# Altium schematic sheet S7CAS-PLEIADES-CARTE-MERE_P20_DAC-ADC-Decoupling.SchDoc
size Tabloid; SheetNumber: 18; SheetTotal: 20; Sheet_Name: DAC ADC Decoupling; Size: 11x17
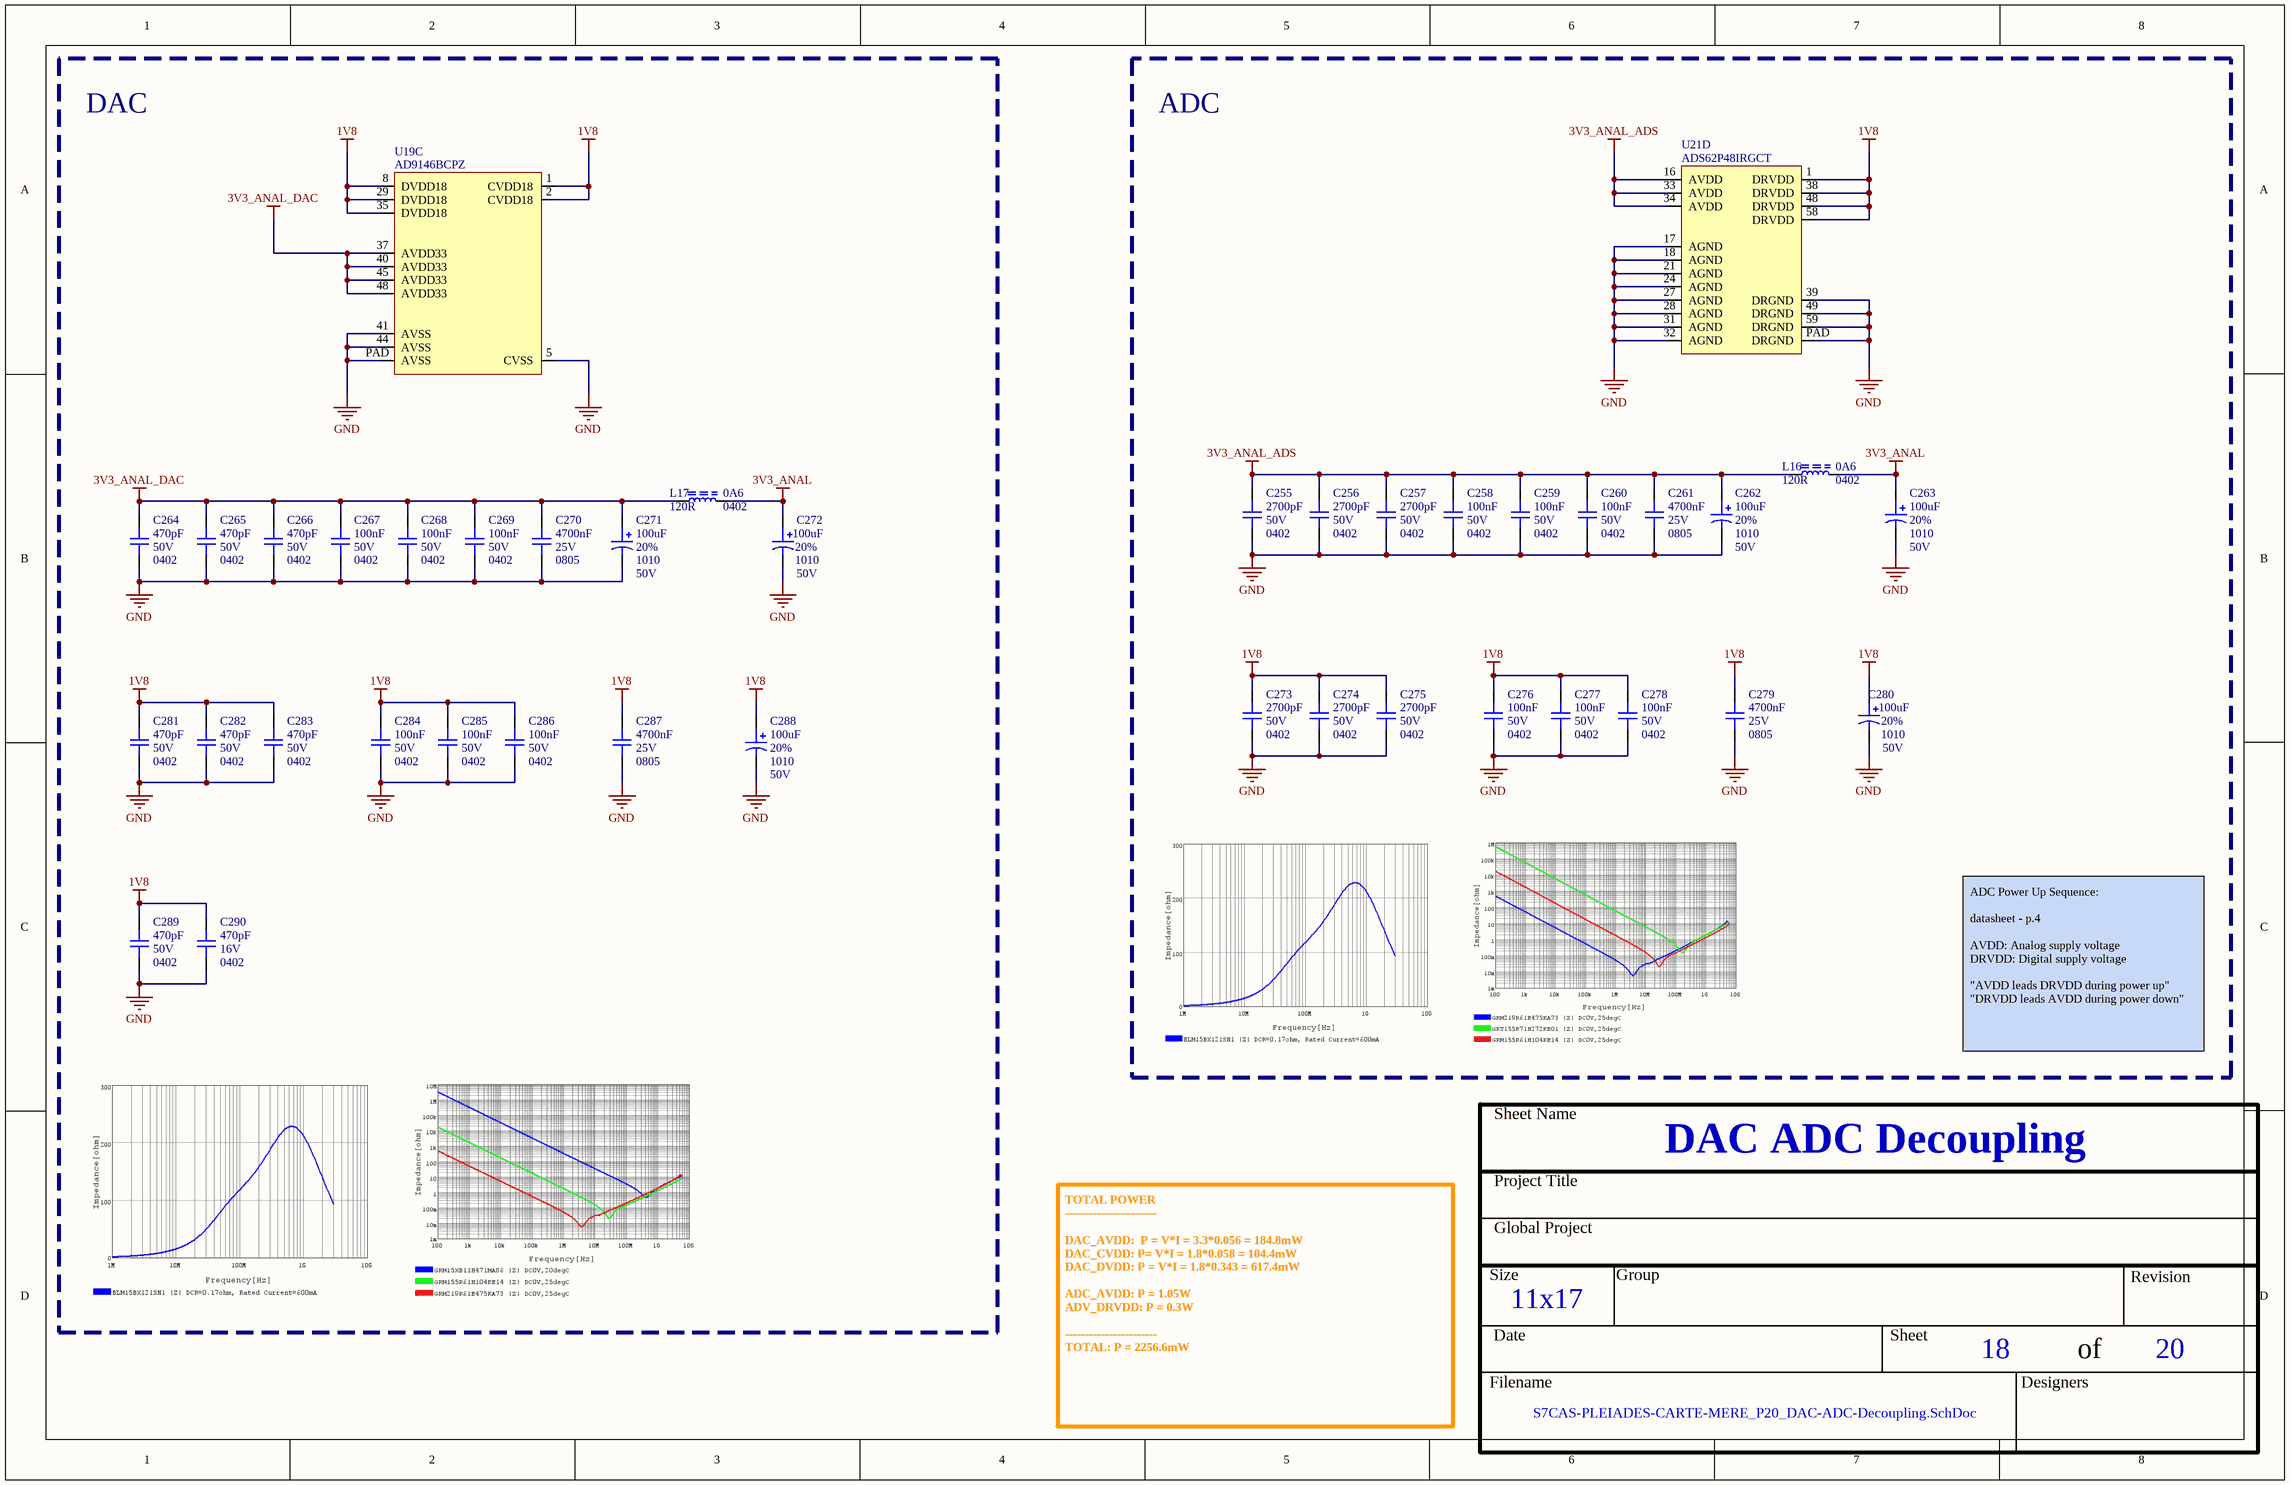
[diagram p0: S7CAS-PLEIADES-CARTE-MERE_P20_DAC-ADC-Decoupling.SchDoc]

## Parts
C255  value 2700pF  Voltage: 50V  Package: 0402  [CAP_0402]  (hidden comment: CAP - 0402)
C256  value 2700pF  Voltage: 50V  Package: 0402  [CAP_0402]  (hidden comment: CAP - 0402)
C257  value 2700pF  Voltage: 50V  Package: 0402  [CAP_0402]  (hidden comment: CAP - 0402)
C258  value 100nF  Voltage: 50V  Package: 0402  [CAP_0402]  (hidden comment: CAP - 0402)
C259  value 100nF  Voltage: 50V  Package: 0402  [CAP_0402]  (hidden comment: CAP - 0402)
C260  value 100nF  Voltage: 50V  Package: 0402  [CAP_0402]  (hidden comment: CAP - 0402)
C261  value 4700nF  Voltage: 25V  Package: 0805  [CAP_0805]  (hidden comment: CAP - 0805)
C262  value 100uF  Voltage: 50V  Package: 1010  Precision: 20%  [CAP_ALU_1010_vishay]  (hidden comment: MAL215099101E3)
C263  value 100uF  Voltage: 50V  Package: 1010  Precision: 20%  [CAP_ALU_1010_vishay]  (hidden comment: MAL215099101E3)
C264  value 470pF  Voltage: 50V  Package: 0402  [CAP_0402]  (hidden comment: CAP - 0402)
C265  value 470pF  Voltage: 50V  Package: 0402  [CAP_0402]  (hidden comment: CAP - 0402)
C266  value 470pF  Voltage: 50V  Package: 0402  [CAP_0402]  (hidden comment: CAP - 0402)
C267  value 100nF  Voltage: 50V  Package: 0402  [CAP_0402]  (hidden comment: CAP - 0402)
C268  value 100nF  Voltage: 50V  Package: 0402  [CAP_0402]  (hidden comment: CAP - 0402)
C269  value 100nF  Voltage: 50V  Package: 0402  [CAP_0402]  (hidden comment: CAP - 0402)
C270  value 4700nF  Voltage: 25V  Package: 0805  [CAP_0805]  (hidden comment: CAP - 0805)
C271  value 100uF  Voltage: 50V  Package: 1010  Precision: 20%  [CAP_ALU_1010_vishay]  (hidden comment: MAL215099101E3)
C272  value 100uF  Voltage: 50V  Package: 1010  Precision: 20%  [CAP_ALU_1010_vishay]  (hidden comment: MAL215099101E3)
C273  value 2700pF  Voltage: 50V  Package: 0402  [CAP_0402]  (hidden comment: CAP - 0402)
C274  value 2700pF  Voltage: 50V  Package: 0402  [CAP_0402]  (hidden comment: CAP - 0402)
C275  value 2700pF  Voltage: 50V  Package: 0402  [CAP_0402]  (hidden comment: CAP - 0402)
C276  value 100nF  Voltage: 50V  Package: 0402  [CAP_0402]  (hidden comment: CAP - 0402)
C277  value 100nF  Voltage: 50V  Package: 0402  [CAP_0402]  (hidden comment: CAP - 0402)
C278  value 100nF  Voltage: 50V  Package: 0402  [CAP_0402]  (hidden comment: CAP - 0402)
C279  value 4700nF  Voltage: 25V  Package: 0805  [CAP_0805]  (hidden comment: CAP - 0805)
C280  value 100uF  Voltage: 50V  Package: 1010  Precision: 20%  [CAP_ALU_1010_vishay]  (hidden comment: MAL215099101E3)
C281  value 470pF  Voltage: 50V  Package: 0402  [CAP_0402]  (hidden comment: CAP - 0402)
C282  value 470pF  Voltage: 50V  Package: 0402  [CAP_0402]  (hidden comment: CAP - 0402)
C283  value 470pF  Voltage: 50V  Package: 0402  [CAP_0402]  (hidden comment: CAP - 0402)
C284  value 100nF  Voltage: 50V  Package: 0402  [CAP_0402]  (hidden comment: CAP - 0402)
C285  value 100nF  Voltage: 50V  Package: 0402  [CAP_0402]  (hidden comment: CAP - 0402)
C286  value 100nF  Voltage: 50V  Package: 0402  [CAP_0402]  (hidden comment: CAP - 0402)
C287  value 4700nF  Voltage: 25V  Package: 0805  [CAP_0805]  (hidden comment: CAP - 0805)
C288  value 100uF  Voltage: 50V  Package: 1010  Precision: 20%  [CAP_ALU_1010_vishay]  (hidden comment: MAL215099101E3)
C289  value 470pF  Voltage: 50V  Package: 0402  [CAP_0402]  (hidden comment: CAP - 0402)
C290  value 470pF  Voltage: 16V  Package: 0402  [CAP_0402]  (hidden comment: CAP - 0402)
L16  value 120R  Current: 0A6  Package: 0402  [FER_0402]  (hidden comment: FER - 0402)
L17  value 120R  Current: 0A6  Package: 0402  [FER_0402]  (hidden comment: FER - 0402)
U19  AD9146BCPZ  [DAC_AD9146BCPZ]  (part C of 3)
U21  ADS62P48IRGCT  [ADC_ADS62P48IRGCT]  (part D of 4)

## Blocks framed on the sheet
DAC: C264-C272 C281-C290 L17 U19
ADC: C255-C263 C273-C280 L16 U21

## Nets
1V8: C273.2 C274.2 C275.2 C276.2 C277.2 C278.2 C279.2 C280.1 C281.2 C282.2 C283.2 C284.2 C285.2 C286.2 C287.2 C288.1 C289.2 C290.2 U19.1(CVDD18) U19.2(CVDD18) U19.8(DVDD18) U19.29(DVDD18) U19.35(DVDD18) U21.1(DRVDD) U21.38(DRVDD) U21.48(DRVDD) U21.58(DRVDD)
3V3_ANAL: C263.1 C272.1 L16.1 L17.1
3V3_ANAL_ADS: C255.2 C256.2 C257.2 C258.2 C259.2 C260.2 C261.2 C262.1 L16.2 U21.16(AVDD) U21.33(AVDD) U21.34(AVDD)
3V3_ANAL_DAC: C264.2 C265.2 C266.2 C267.2 C268.2 C269.2 C270.2 C271.1 L17.2 U19.37(AVDD33) U19.40(AVDD33) U19.45(AVDD33) U19.48(AVDD33)
GND: C255.1 C256.1 C257.1 C258.1 C259.1 C260.1 C261.1 C262.2 C263.2 C264.1 C265.1 C266.1 C267.1 C268.1 C269.1 C270.1 C271.2 C272.2 C273.1 C274.1 C275.1 C276.1 C277.1 C278.1 C279.1 C280.2 C281.1 C282.1 C283.1 C284.1 C285.1 C286.1 C287.1 C288.2 C289.1 C290.1 U19.5(CVSS) U19.41(AVSS) U19.44(AVSS) U19.PAD(AVSS) U21.17(AGND) U21.18(AGND) U21.21(AGND) U21.24(AGND) U21.27(AGND) U21.28(AGND) U21.31(AGND) U21.32(AGND) U21.39(DRGND) U21.49(DRGND) U21.59(DRGND) U21.PAD(DRGND)

## Notes on the sheet
- ADC Power Up Sequence:
  datasheet - p.4
  AVDD: Analog supply voltage
  DRVDD: Digital supply voltage
  "AVDD leads DRVDD during power up"
  "DRVDD leads AVDD during power down"
- TOTAL POWER
  -----------------------
  DAC_AVDD:  P = V*I = 3.3*0.056 = 184.8mW
  DAC_CVDD: P= V*I = 1.8*0.058 = 104.4mW
  DAC_DVDD: P = V*I = 1.8*0.343 = 617.4mW
  ADC_AVDD: P = 1.05W
  ADV_DRVDD: P = 0.3W
  -----------------------
  TOTAL: P = 2256.6mW
- Sheet Name
- Project Title
- Global Project
- Size
- Group
- Revision
- Date
- Sheet
- of
- Filename
- Designers

## Library data of the parts
C255-C257 C273-C275 = CAP - 0402: Mfg Part Number: GRT155R71H272KE01; Precision: 10%; Current: *; CreatedBy: Jonathan Bouchard; Power: *
C258-C260 C267-C269 C276-C278 C284-C286 = CAP - 0402: Mfg Part Number: GRM155R61H104KE14; Precision: 10%; Current: *; CreatedBy: Jonathan Bouchard; Power: *
C261 C270 C279 C287 = CAP - 0805: Mfg Part Number: GRM219R61E475KA73; Precision: 10%; Current: *; CreatedBy: Jonathan Bouchard; Power: *
C262 C263 C271 C272 C280 C288 = CAP_ALU_MAL215099101E3: CAP - ALU 100uF 20% 50V - 1010; Current: 490mA; Mfg: Vishay Dale; Mfg Part Number: MAL215099101E3; HelpURL: http://www.vishay.com/docs/28395/150crz.pdf; CreatedBy: Jonathan Bouchard; Temperature: -55°C to 125°C; Power: *; Supplier 1: Digikey; Supplier Part Number 1: 4399PHDKR-ND
C264-C266 C281-C283 C289 = CAP - 0402: Mfg Part Number: GRM1555C1H471GA01; Precision: 2%; Current: *; HelpURL: https://search.murata.co.jp/Ceramy/image/img/A01X/G101/ENG/GRM1555C1H471GA01-01.pdf; CreatedBy: Jonathan Bouchard; Power: *
C290 = CAP - 0402: Mfg Part Number: GRM15XB11H471MA86; Precision: 10%; Current: *; CreatedBy: Jonathan Bouchard; Power: *
L16 L17 = FER - 0402: Mfg Part Number: BLM15BX121SN1; Voltage: *; CreatedBy: Jonathan Bouchard; Power: *; Precision: *
U19 = DAC_AD9146BCPZ: DAC - 16BIT SRL HIGH SPEED - QFN-48; Voltage: 3.13 V ~ 3.47 V / 1.71 V ~ 1.89 V; Mfg: Analog Devices Inc.; Current: *; Power: *; Mfg Part Number: AD9146BCPZ; HelpURL: http://www.analog.com/media/en/technical-documentation/data-sheets/AD9146.PDF; CreatedBy: Jonathan Bouchard; Temperature: -40°C ~ 85°C; Value: *; Precision: 16 Bit; Package: QFN-48; Supplier 1: Digikey; Supplier Part Number 1: AD9146BCPZ-ND
U21 = ADC_ADS62P48IRGCT: ADC - 14 BIT 210MSPS SUAL - VQFN-64; Voltage: 3.15 V ~ 3.6 V / 1.7 V ~ 1.9 V; Mfg: Texas Instruments; Precision: 14 Bit; Current: *; Power: *; Mfg Part Number: ADS62P48IRGCT; HelpURL: http://www.ti.com/lit/ds/symlink/ads62p48.pdf; CreatedBy: Jonathan Bouchard; Temperature: -40°C ~ 85°C; Value: *; Package: VQFN-64; Supplier 1: Digikey; Supplier Part Number 1: 296-24611-1-ND